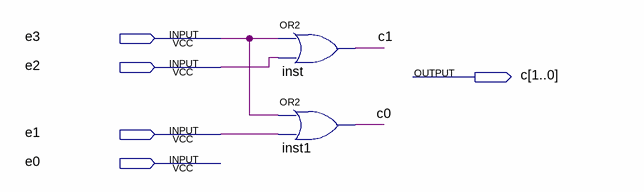
[diagram p0: schematic sheet]
// Quartus schematic mbr_cod4x2.bdf as structural Verilog: 2 symbols, 5 pins
module mbr_cod4x2 (
  input  e3,
  input  e2,
  input  e1,
  input  e0,
  output [1:0] c
);

  or inst (c[1], e3, e2);
  or inst1 (c[0], e3, e1);
endmodule
